# EAGLE design SALS (EAGLE 9.5.2)
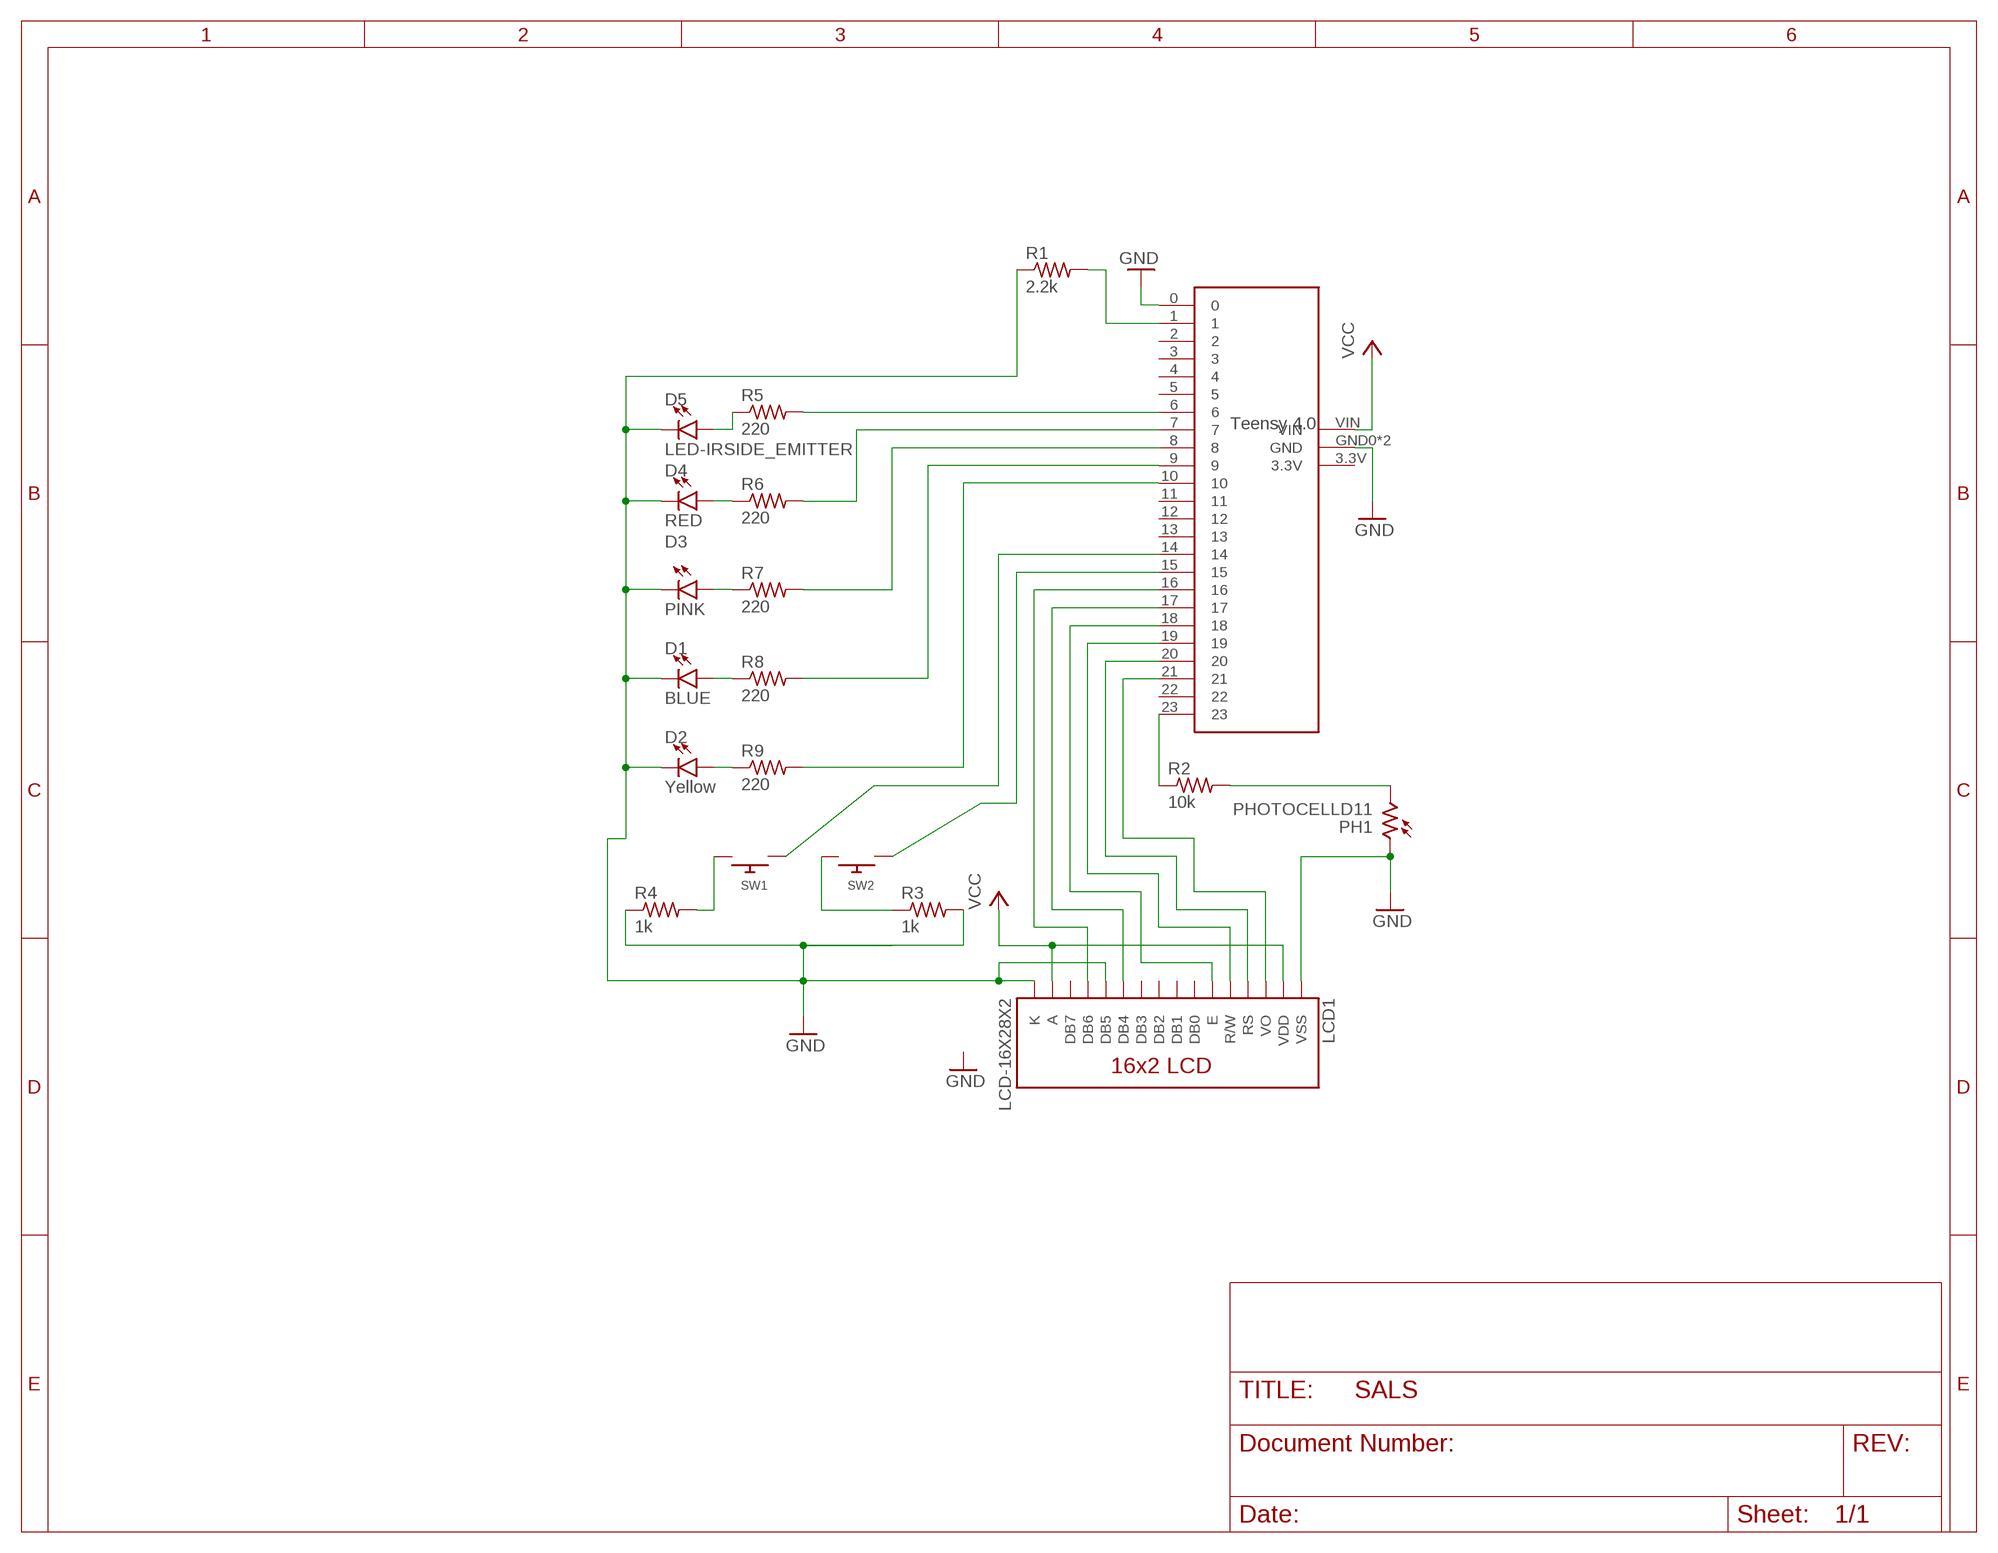
[diagram p0: schematic, sheet 1]

## Parts
D1  BLUE  LED-BLUE0603  [LED-0603]
D2  Yellow  LED-YELLOW0603  [LED-0603]
D3  PINK  LED-PINK1206  [LED-1206]
D4  RED  LED-RED0603  [LED-0603]
D5  LED-IRSIDE_EMITTER  [LTE-302]
LCD1  LCD-16X28X2  [LCD-8X2]
PH1  PHOTOCELLD11  [D11XX_H]
R1  2.2k  R-US_0204/5  [0204/5]
R2  10k  R-US_0204/5  [0204/5]
R3  1k  R-US_0204/5  [0204/5]
R4  1k  R-US_0204/5  [0204/5]
R5  220  R-US_0204/5  [0204/5]
R6  220  R-US_0204/5  [0204/5]
R7  220  R-US_0204/5  [0204/5]
R8  220  R-US_0204/5  [0204/5]
R9  220  R-US_0204/5  [0204/5]
SW1  SWITCH_PUSHBUTTONEVQ-PE  [TACT_PANA-EVQ]
SW2  SWITCH_PUSHBUTTONEVQ-PE  [TACT_PANA-EVQ]
U$1  TEENSY_4.0  [TEENSY_4.0]

## Nets
GND: D1.C D2.C D3.C D4.C D5.C LCD1.1(VSS) LCD1.12(DB5) LCD1.16(K) PH1.1 R1.1 R3.2 R4.1 U$1.0 U$1.GND0(GND) U$1.GND1(GND)
N$1: D5.A R5.1
N$2: D4.A R6.1
N$3: D3.A R7.1
N$4: D1.A R8.1
N$5: D2.A R9.1
N$7: PH1.2 R2.2
N$8: LCD1.11(DB4) U$1.17
N$9: R1.2 U$1.1
N$11: R4.2 SW1.P$2
N$12: R3.1 SW2.P$2
N$13: LCD1.13(DB6) U$1.16
N$14: R2.1 U$1.23
N$15: R5.2 U$1.6
N$16: R6.2 U$1.7
N$17: R7.2 U$1.8
N$18: R8.2 U$1.9
N$19: R9.2 U$1.10
N$20: SW1.P$1 U$1.14
N$21: SW2.P$1 U$1.15
N$23: LCD1.5(R/W) U$1.19
N$24: LCD1.6(E) U$1.18
N$25: LCD1.4(RS) U$1.20
N$26: LCD1.3(VO) U$1.21
VCC: LCD1.2(VDD) LCD1.15(A) U$1.VIN
Unconnected: LCD1.7(DB0) LCD1.8(DB1) LCD1.9(DB2) LCD1.10(DB3) LCD1.14(DB7) U$1.2 U$1.3 U$1.3.3V U$1.4 U$1.5 U$1.11 U$1.12 U$1.13 U$1.22

## Library data of the parts
D1 = SparkFun-LED:LED-BLUE: Blue SMD LED Used in manufacturing of various products at SparkFun Packages: 0603 - SMD 0603 package [Product Link] <http://www.digikey.com/product-detail/en/SMLE12BC7TT86/511-1589-2-ND/1641808> 1206 - SMD1206 package [Product Link] <http://www.digikey.com/product-detail/en/lite-on-inc/LTST-C150TBKT/160-1643-1-ND/573584> SparkFun Products: ESP8266 Thing-Dev Board <https://www.sparkfun.com/products/13711> RedBoard <https://www.sparkfun.com/products/12757>; PROD_ID: DIO-08575
D2 = SparkFun-LED:LED-YELLOW: Yellow SMD LED Used in manufacturing several products at SparkFun. Packages: 0603 - SMD 0603 package[Product Link] <http://www.kingbrightusa.com/product.asp?catalog_name=LED&product_id=APT1608SYCK> 0603 -SMART - SMART SMD 0603 package (more efficient/more expensive) [Product Link] <http://www.osram-os.com/osram_os/en/products/product-catalog/led-light-emitting-diodes/smartled-0603/ly-l29k/index.jsp> LilyPad - SMD1206 package[Product Datasheet] <https://www.sparkfun.com/datasheets/DevTools/LilyPad/Q150YUS4.pdf> SparkFun Products: Blynk Board <https://www.sparkfun.com/products/13794> IOIO-OTG <https://www.sparkfun.com/products/13613> XBee Explorer Serial <https://www.sparkfun.com/products/13225>; PROD_ID: DIO-09003
D3 = SparkFun-LED:LED-PINK: Pink SMD LED Used in manufacturing of various products at SparkFun Packages: 0603 - SMD 0603 package [Product Link] <http://cdn.sparkfun.com/datasheets/Components/General/S1206PKSBJC.pdf> SparkFun Products: LilyPad LED Pink <https://www.sparkfun.com/products/10962>; PROD_ID: DIO-10415
D4 = SparkFun-LED:LED-RED: Red SMD LED Used in manufacturing of most products at SparkFun Packages: 0603 - SMD 0603 package [Product Link] <http://docs.avagotech.com/docs/AV02-0551EN> 0603 SMART - SMD 0603 SMART package ( more efficient and expensive)[Product Link] <http://www.osram-os.com/Graphics/XPic2/00077099_0.pdf> 1206 - SMD1206 package [Product Link] <https://www.sparkfun.com/datasheets/DevTools/LilyPad/Q150OVS4.pdff> SparkFun Products: Pro Mini 328 -5V <https://www.sparkfun.com/products/821> RedBoard <https://www.sparkfun.com/products/12757> IOIO-OTG <https://www.sparkfun.com/products/13613>; PROD_ID: DIO-00819
D5 = SparkFun-LED:LED-IR: Infrared LED (IR) Wavelength: 940nm Packages: TSAL6100 LTE302 - Side firing. Check SparkFun-Sensors.lbr for the receiver SparkFun Products: ZX Distance and Gesture Sensor <[https://www.sparkfun.com/products/12780]> Infrared Emitters and Detectors <https://www.sparkfun.com/products/241>; PROD_ID: DIO-10904; SF_ID: SEN-00241
LCD1 = SparkFun-Displays:LCD-16X2: Standard text-only 16x2 parallel input LCD Basic 16 character by 2 line display. Typically utilizes the extremely common HD44780 parallel interface chipset SparkFun Products: Basic 16x2 Green <https://www.sparkfun.com/products/255> Basic 8x2 Green <https://www.sparkfun.com/products/11122>; SF_ID: LCD-11122
PH1 = photo-elements:PHOTOCELL: Photo Sensor
R1-R9 = adafruit:R-US_: RESISTOR, American symbol
SW1 SW2 = adafruit:SWITCH_PUSHBUTTON: Buttons SOFTTOUCHSMD_SJ - Soft touch temporary push button (Super Junk Akihabara) Compatible with SKPMANE010 [Mouser: 688-SKPMAN] C&K_KSS = Digikey: KSS221GLFS
U$1 = custom:TEENSY_4.0; TYPE: Teensy 4.0

## Board
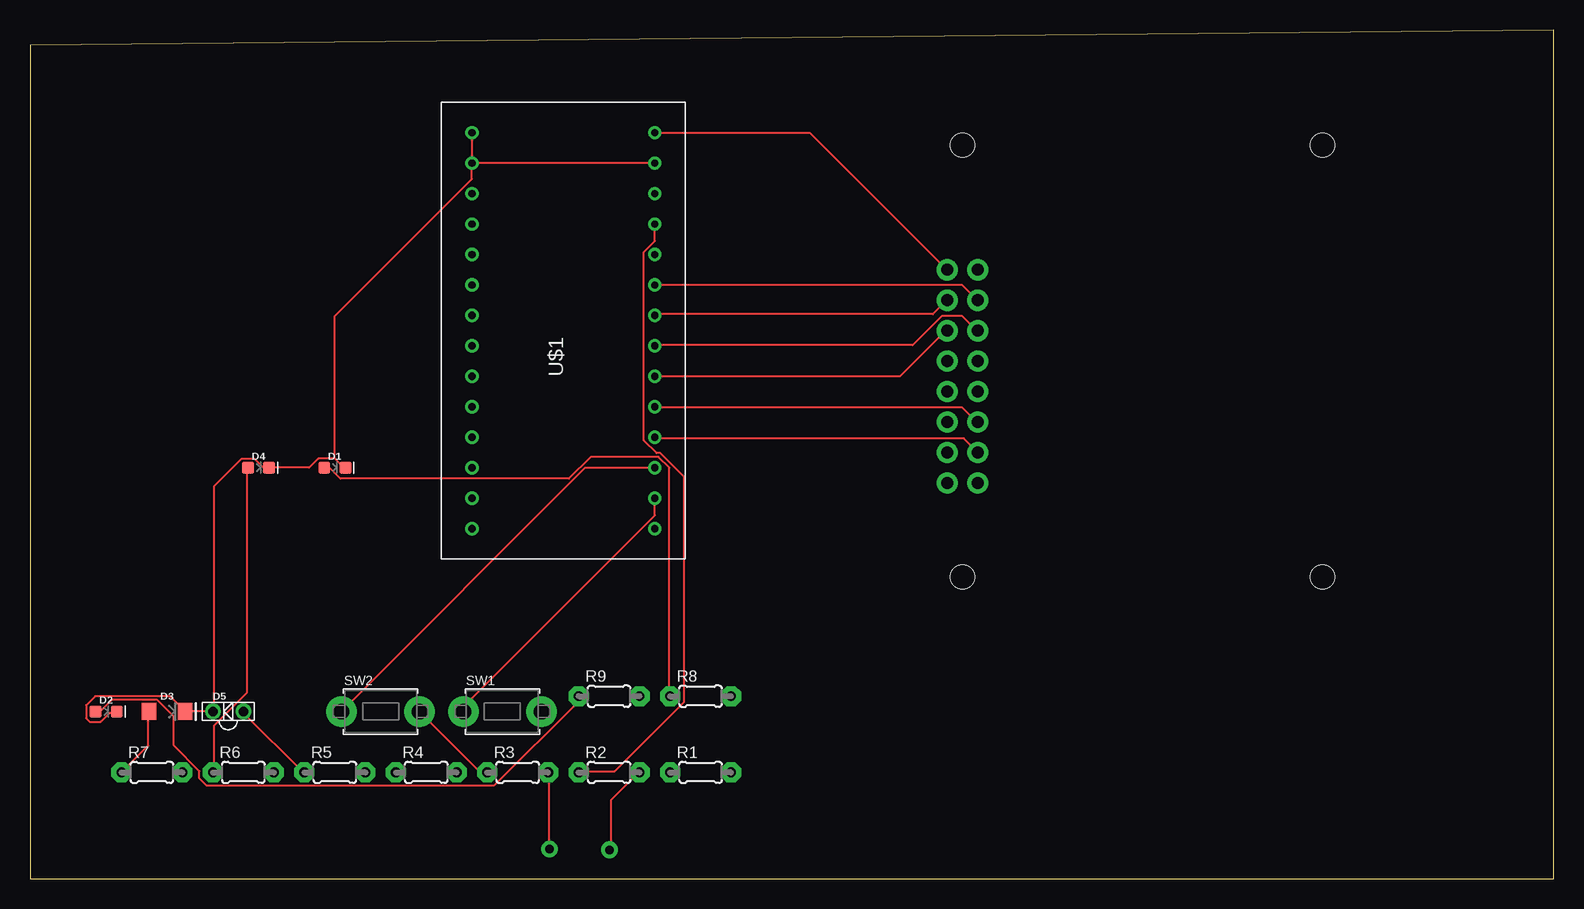
[diagram p1: board, top side]
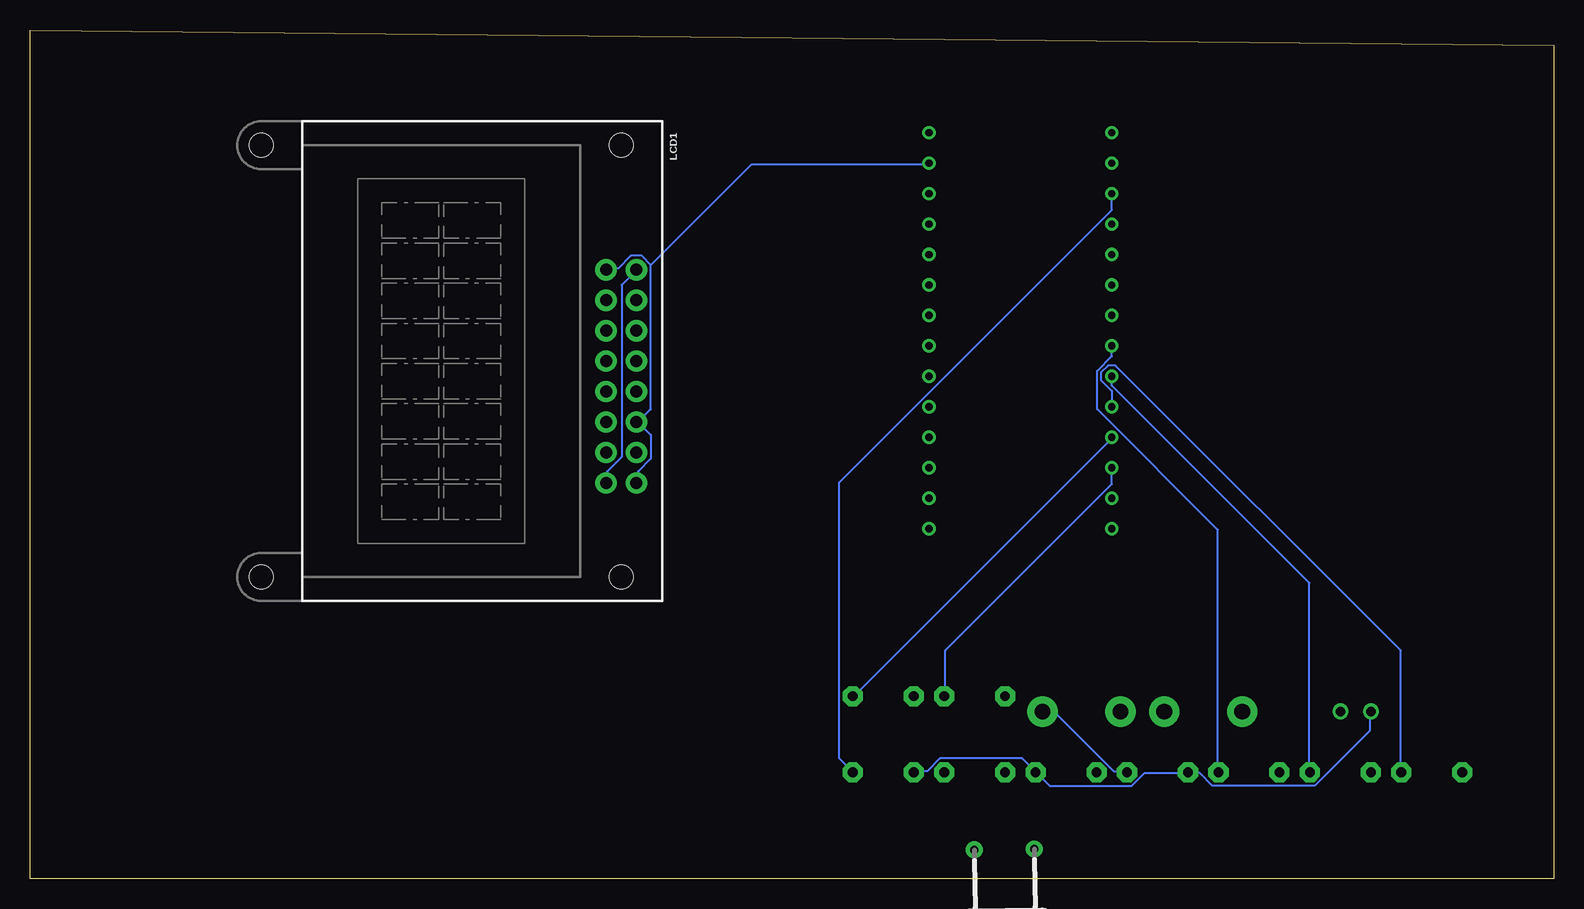
[diagram p2: board, bottom side, seen from below]

Size 126.98 x 70.79 mm. Coordinates in mm from the lower left corner, seen from the top.
Outline: 0,0 126.98,0 126.98,70.79 0,69.52 0,0
Copper layers (1*16): Top 0.035mm / dielectric 1.5mm / Bottom 0.035mm
Design rules "OthermillDRC_30_deg_v2": minimum track width 6mil, minimum drill 0.8mm, track to track 6mil, track to pad 6mil, pad to pad 6mil, via to via 6mil, smd to smd 0mil, copper to edge 0mil, drill to drill 6mil, minimum pad ring 10mil, minimum via ring 10mil, stop-mask expansion 1mil, vias tented up to drill 30mil, thermal gap 6mil

### Footprints (pad centres in the part's own frame; a part is rotated, then mirrored left to right if it is on the bottom)
LED-0603 = smd 1 x 1: A -0.877,0; C 0.877,0
LED-1206 = smd 1.2 x 1.4: A -1.5,0; C 1.5,0
LTE-302 = drill 0.8: A 1.27,0; C -1.27,0
LCD-8X2 = drill 1 pad 1.778: 1 -7.62,13.73; 2 -7.62,16.27; 3 -5.08,13.73; 4 -5.08,16.27; 5 -2.54,13.73; 6 -2.54,16.27; 7 0,13.73; 8 0,16.27; 9 2.54,13.73; 10 2.54,16.27; 11 5.08,13.73; 12 5.08,16.27; 13 7.62,13.73; 14 7.62,16.27; 15 10.16,13.73; 16 10.16,16.27 | hole 2: 18,15; -18,15; -18,-15; 18,-15
D11XX_H = drill 0.7 pad 1.4: 1 -2.5,-5; 2 2.5,-5
0204/5 = drill 0.813 pad 1.676 octagon: 1 -2.54,0; 2 2.54,0
TACT_PANA-EVQ = drill 1.3 pad 2.54: P$1 -3.25,0; P$2 3.25,0
TEENSY_4.0 = drill 0.6: 0 -7.62,12.7; 1 -7.62,10.16; 2 -7.62,7.62; 3 -7.62,5.08; 3.3V 7.62,10.16; 4 -7.62,2.54; 5 -7.62,0; 6 -7.62,-2.54; 7 -7.62,-5.08; 8 -7.62,-7.62; 9 -7.62,-10.16; 10 -7.62,-12.7; 11 -7.62,-15.24; 12 -7.62,-17.78; 13 7.62,-17.78; 14 7.62,-15.24; 15 7.62,-12.7; 16 7.62,-10.16; 17 7.62,-7.62; 18 7.62,-5.08; 19 7.62,-2.54; 20 7.62,0; 21 7.62,2.54; 22 7.62,5.08; 23 7.62,7.62; GND0 -7.62,15.24; GND1 7.62,12.7; VIN 7.62,15.24

### Placement (x,y rotation side)
D1  25.4,34.29 0 top
D2  6.35,13.97 0 top
D3  11.43,13.97 0 top
D4  19.05,34.29 0 top
D5  16.51,13.97 0 top
LCD1  92.71,43.18 270 bottom
PH1  45.72,-2.54 180.8 bottom
R1  55.88,8.89 0 top
R2  48.26,8.89 0 top
R3  40.64,8.89 0 top
R4  33.02,8.89 0 top
R5  25.4,8.89 0 top
R6  17.78,8.89 0 top
R7  10.16,8.89 0 top
R8  55.88,15.24 0 top
R9  48.26,15.24 0 top
SW1  39.37,13.97 0 top
SW2  29.21,13.97 0 top
U$1  44.45,46.99 0 top

### Tracks (layer width: path | path; a pad name or v marks a point on that pad's centre or on a via)
GND
  Top 0.152: U$1.GND0 36.83,59.74 | 36.83,59.74 52.07,59.74 U$1.GND1 | 36.83,59.74 U$1.0 36.83,58.37 25.4,46.94 25.4,35.05 | PH1.1 43.23,2.59 43.23,8.84 R3.2 | 25.4,35.05 24.03,35.05 23.27,34.29 D4.C 19.46,34.29 18.69,35.05 17.63,35.05 15.34,32.77 15.34,14.02 D5.C 15.19,14.02 13.06,14.02 D3.C 12.9,14.02 11.68,15.24 5.44,15.24 4.67,14.48 4.67,13.41 4.98,13.11 5.89,13.11 6.66,13.87 7.11,13.87 D2.C | 25.4,35.05 26.16,34.29 D1.C
  Bottom 0.152: 76.3,38.1 75.23,37.03 75.23,35.05 76.3,33.98 76.3,33.07 LCD1.16 | 75.23,51.21 76,51.97 76.91,51.97 77.98,50.9 78.89,50.9 LCD1.1 | 75.23,51.21 75.23,39.17 76.3,38.1 | 76.3,38.1 LCD1.12 | 75.23,51.21 66.85,59.59 52.07,59.59 U$1.GND1 | R1.1 53.29,8.99 52.22,8.99 51.16,10.06 44.3,10.06 43.23,8.99 R3.2 43.08,8.84 42.01,7.77 35.15,7.77 34.09,8.84 30.58,8.84 R4.1 30.43,8.84 29.51,8.84 28.45,7.77 19.91,7.77 15.34,12.34 15.34,13.87 D5.C
N$1
  Top 0.152: D5.A 17.78,13.87 22.81,8.84 R5.1
N$2
  Top 0.152: D4.A 18.09,34.29 18.09,15.55 15.34,12.8 15.34,8.99 R6.1
N$3
  Top 0.152: R7.1 9.85,11.12 9.85,13.87 D3.A
N$4
  Top 0.152: D1.A 24.94,34.29 25.86,33.38 44.91,33.38 46.74,35.2 52.37,35.2 53.29,34.29 53.29,15.24 R8.1
N$5
  Top 0.152: D2.A 5.59,14.02 5.89,14.02 6.81,14.93 10.62,14.93 11.99,13.56 11.99,11.12 14.12,8.99 14.12,8.38 14.73,7.77 38.66,7.77 45.67,14.78 45.67,15.24 R9.1
N$7
  Top 0.152: PH1.2 48.41,2.44 48.41,6.55 50.7,8.84 R2.2
N$8
  Top 0.152: U$1.17 52.07,39.32 77.67,39.32 78.89,38.1 LCD1.11
N$9
  Bottom 0.152: U$1.1 36.83,55.78 59.54,33.07 59.54,10.06 58.47,8.99 R1.2
N$11
  Bottom 0.152: R4.2 35.61,8.99 36.68,8.99 41.55,13.87 42.47,13.87 SW1.P$2
N$12
  Top 0.152: R3.1 38.05,8.99 37.44,8.99 32.56,13.87 SW2.P$2
N$13
  Top 0.152: U$1.16 52.07,36.73 77.83,36.73 78.89,35.66 LCD1.13
N$14
  Top 0.152: U$1.23 52.07,53.19 51.16,52.27 51.16,36.58 52.22,35.51 52.53,35.51 54.51,33.53 54.51,14.78 48.72,8.99 45.82,8.99 R2.1
N$15
  Bottom 0.152: U$1.6 36.83,43.59 38.05,42.37 38.05,39.17 27.99,29.11 27.99,8.99 R5.2
N$16
  Bottom 0.152: U$1.7 36.83,41.15 20.37,24.69 20.37,8.99 R6.2
N$17
  Bottom 0.152: U$1.8 36.83,40.69 37.74,41.61 37.74,42.22 37.13,42.82 36.52,42.82 12.75,19.05 12.75,8.99 R7.2
N$18
  Bottom 0.152: U$1.9 36.83,36.73 58.32,15.24 R8.2
N$19
  Bottom 0.152: U$1.10 36.83,32.92 50.7,19.05 50.7,15.24 R9.2
N$20
  Top 0.152: U$1.14 52.07,30.33 36.22,14.48 36.22,14.02 SW1.P$1
N$21
  Top 0.152: U$1.15 46.28,34.29 26.01,14.02 SW2.P$1
N$23
  Top 0.152: U$1.19 52.07,44.5 73.56,44.5 76,46.94 77.67,46.94 78.89,45.72 LCD1.5
N$24
  Top 0.152: U$1.18 72.49,41.91 76.3,45.72 LCD1.6
N$25
  Top 0.152: U$1.20 52.07,47.09 75.23,47.09 76.3,48.16 LCD1.4
N$26
  Top 0.152: U$1.21 77.67,49.53 78.89,48.31 LCD1.3
VCC
  Top 0.152: U$1.VIN 52.07,62.18 65.02,62.18 76.3,50.9 LCD1.2
  Bottom 0.152: LCD1.15 78.89,33.07 78.89,33.98 77.67,35.2 77.67,49.53 76.45,50.75 LCD1.2